# EAGLE design v1.2SMD (EAGLE 7.4.0)
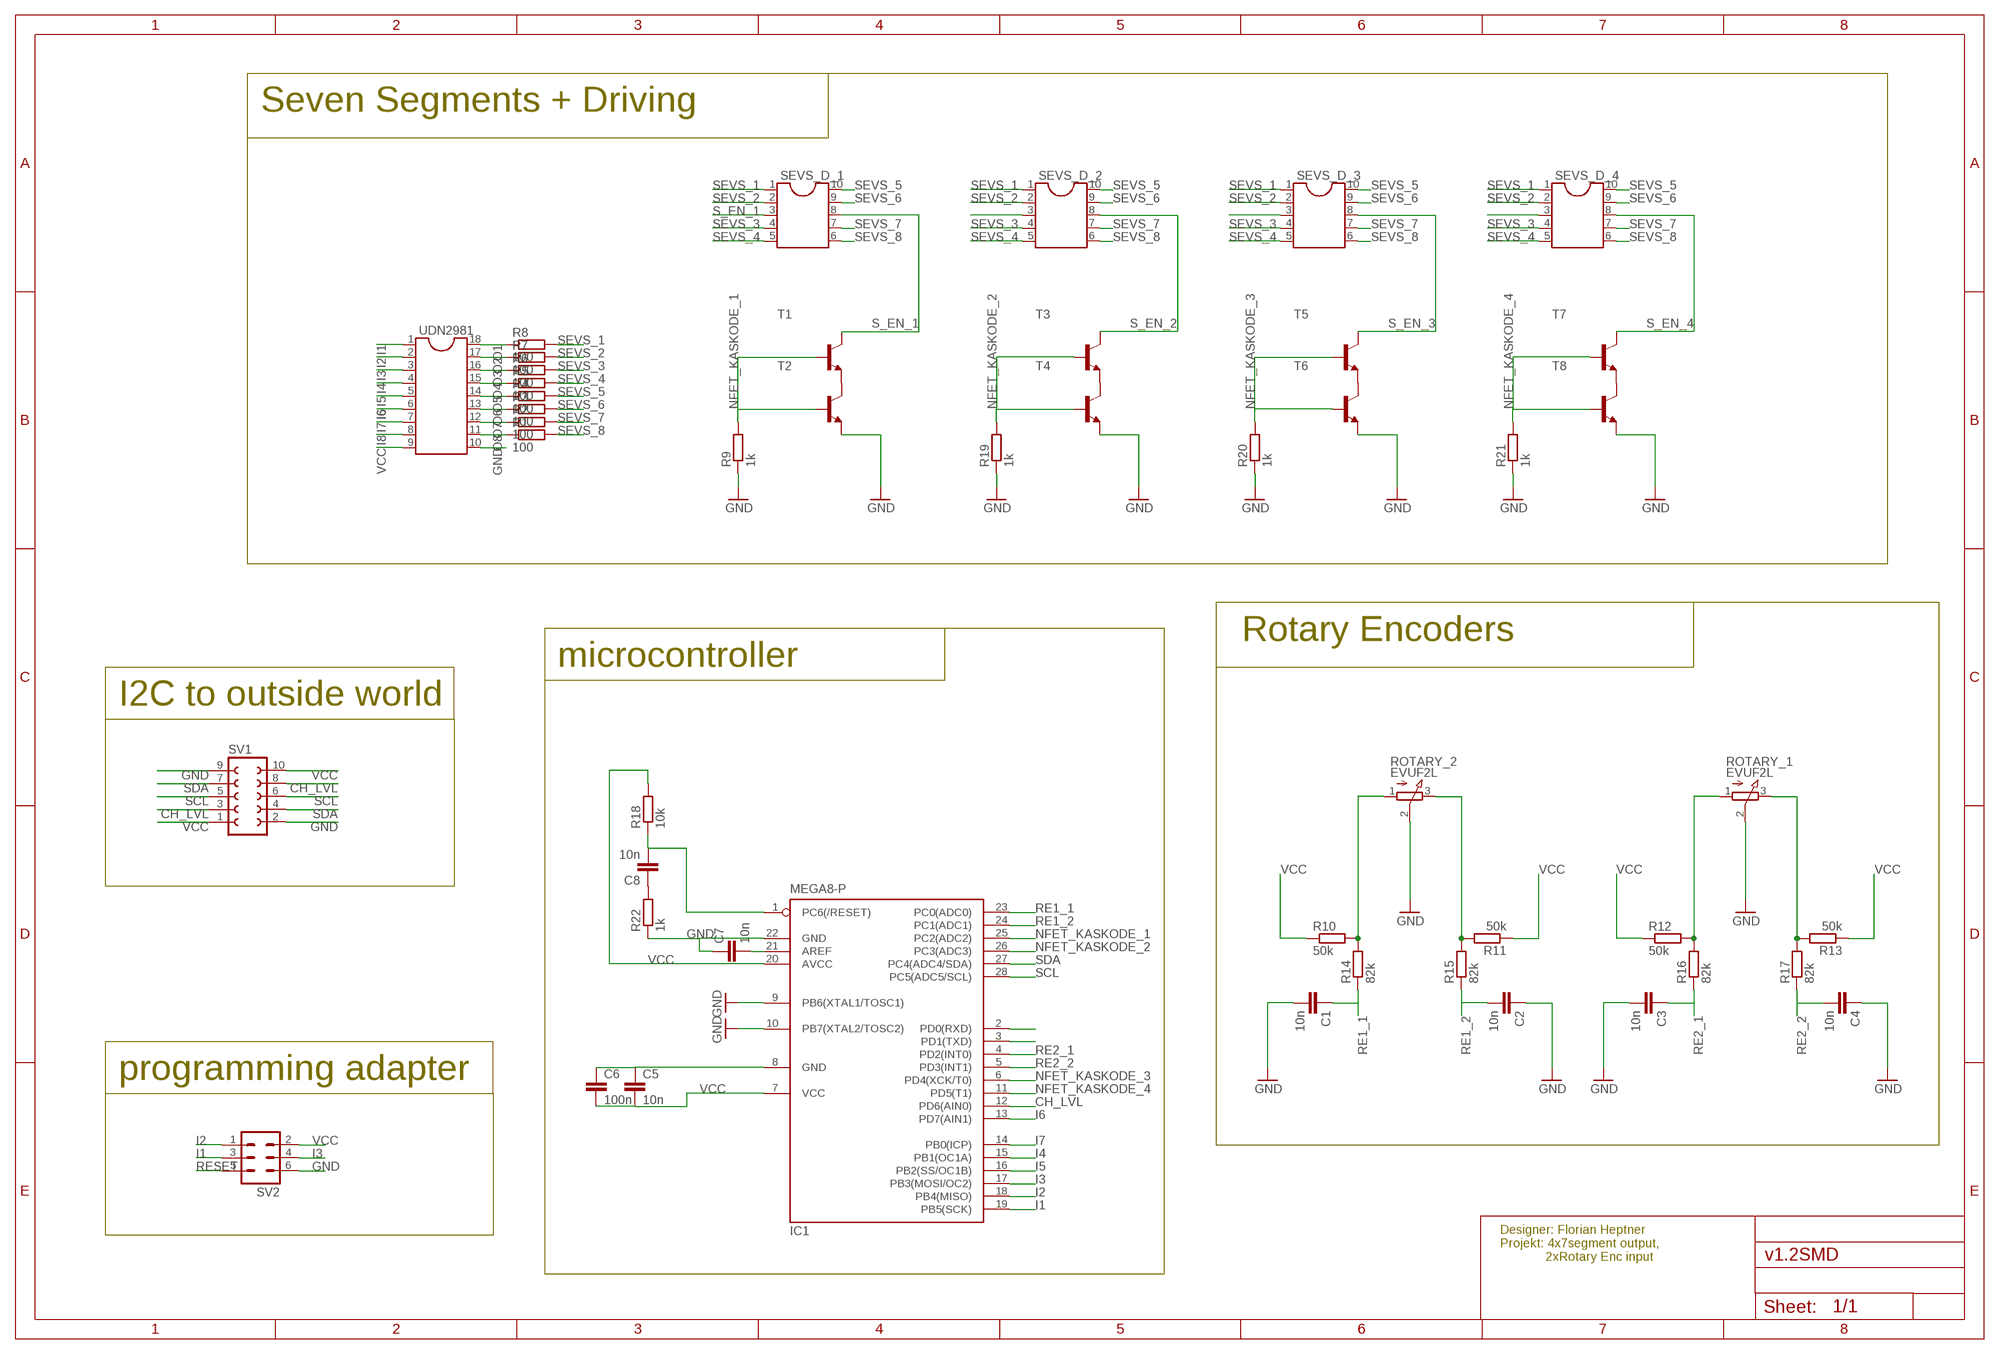
[diagram p0: schematic, sheet 1]

## Parts
C1  10n  C-EUC0603  [C0603]
C2  10n  C-EUC0603  [C0603]
C3  10n  C-EUC0603  [C0603]
C4  10n  C-EUC0603  [C0603]
C5  10n  C-EUC0603  [C0603]
C6  100n  C-EUC0603  [C0603]
C7  10n  C-EUC0603  [C0603]
C8  10n  C-EUC0603  [C0603]
IC1  MEGA8-P  [DIL28-3]
R1  100  R-EU_R0603  [R0603]
R2  100  R-EU_R0603  [R0603]
R3  100  R-EU_R0603  [R0603]
R4  100  R-EU_R0603  [R0603]
R5  100  R-EU_R0603  [R0603]
R6  100  R-EU_R0603  [R0603]
R7  100  R-EU_R0603  [R0603]
R8  100  R-EU_R0603  [R0603]
R9  1k  R-EU_R0603  [R0603]
R10  50k  R-EU_R0603  [R0603]
R11  50k  R-EU_R0603  [R0603]
R12  50k  R-EU_R0603  [R0603]
R13  50k  R-EU_R0603  [R0603]
R14  82k  R-EU_R0603  [R0603]
R15  82k  R-EU_R0603  [R0603]
R16  82k  R-EU_R0603  [R0603]
R17  82k  R-EU_R0603  [R0603]
R18  10k  R-EU_R0603  [R0603]
R19  1k  R-EU_R0603  [R0603]
R20  1k  R-EU_R0603  [R0603]
R21  1k  R-EU_R0603  [R0603]
R22  1k  R-EU_R0603  [R0603]
ROTARY_1  EVUF2L  [EVUFXL]
ROTARY_2  EVUF2L  [EVUFXL]
SEVS_D_1  DIL10  [DIL10]
SEVS_D_2  DIL10  [DIL10]
SEVS_D_3  DIL10  [DIL10]
SEVS_D_4  DIL10  [DIL10]
SV1  FE05-2  [FE05-2]
SV2  ML6  [ML6]
T1  BC808-NPN-SOT23-BEC  [SOT23-BEC]
T2  BC808-NPN-SOT23-BEC  [SOT23-BEC]
T3  BC808-NPN-SOT23-BEC  [SOT23-BEC]
T4  BC808-NPN-SOT23-BEC  [SOT23-BEC]
T5  BC808-NPN-SOT23-BEC  [SOT23-BEC]
T6  BC808-NPN-SOT23-BEC  [SOT23-BEC]
T7  BC808-NPN-SOT23-BEC  [SOT23-BEC]
T8  BC808-NPN-SOT23-BEC  [SOT23-BEC]
UDN2981  DIL18  [DIL18]

## Nets
CH_LVL: IC1.12(PD6(AIN0)) SV1.3 SV1.8
GND: C1.2 C2.1 C3.2 C4.1 C7.1 IC1.9(PB6(XTAL1/TOSC1)) IC1.10(PB7(XTAL2/TOSC2)) IC1.22(GND) R9.1 R19.1 R20.1 R21.1 R22.1 ROTARY_1.2(S) ROTARY_2.2(S) SV1.2 SV1.9 SV2.6 T2.E T4.E T6.E T8.E UDN2981.10
I1: IC1.19(PB5(SCK)) SV2.3 UDN2981.1
I2: IC1.18(PB4(MISO)) SV2.1 UDN2981.2
I3: IC1.17(PB3(MOSI/OC2)) SV2.4 UDN2981.3
I4: IC1.15(PB1(OC1A)) UDN2981.4
I5: IC1.16(PB2(SS/OC1B)) UDN2981.5
I6: IC1.13(PD7(AIN1)) UDN2981.6
I7: IC1.14(PB0(ICP)) UDN2981.7
I8: UDN2981.8
N$1: R11.2 R15.2 ROTARY_2.3(E)
N$2: C8.1 R22.2
N$3: IC1.3(PD1(TXD))
N$4: R10.2 R14.2 ROTARY_2.1(A)
N$5: R12.2 R16.2 ROTARY_1.1(A)
N$6: R13.2 R17.2 ROTARY_1.3(E)
N$7: T1.E T2.C
N$8: T3.E T4.C
N$9: T5.E T6.C
N$10: T7.E T8.C
N$11: IC1.2(PD0(RXD))
N$12: C5.1 C6.1 IC1.8(GND)
N$15: C7.2 IC1.21(AREF)
NFET_KASKODE_1: IC1.25(PC2(ADC2)) R9.2 T1.B T2.B
NFET_KASKODE_2: IC1.26(PC3(ADC3)) R19.2 T3.B T4.B
NFET_KASKODE_3: IC1.6(PD4(XCK/T0)) R20.2 T5.B T6.B
NFET_KASKODE_4: IC1.11(PD5(T1)) R21.2 T7.B T8.B
O1: R8.1 UDN2981.18
O2: R7.1 UDN2981.17
O3: R6.1 UDN2981.16
O4: R5.1 UDN2981.15
O5: R4.1 UDN2981.14
O6: R3.1 UDN2981.13
O7: R2.1 UDN2981.12
O8: R1.1 UDN2981.11
RE1_1: C1.1 IC1.23(PC0(ADC0)) R14.1
RE1_2: C2.2 IC1.24(PC1(ADC1)) R15.1
RE2_1: C3.1 IC1.4(PD2(INT0)) R16.1
RE2_2: C4.2 IC1.5(PD3(INT1)) R17.1
RESET: C8.2 IC1.1(PC6(/RESET)) R18.1 SV2.5
S_EN_1: SEVS_D_1.3 SEVS_D_1.8 T1.C
S_EN_2: SEVS_D_2.3 SEVS_D_2.8 T3.C
S_EN_3: SEVS_D_3.3 SEVS_D_3.8 T5.C
S_EN_4: SEVS_D_4.3 SEVS_D_4.8 T7.C
SCL: IC1.28(PC5(ADC5/SCL)) SV1.5 SV1.6
SDA: IC1.27(PC4(ADC4/SDA)) SV1.4 SV1.7
SEVS_1: R8.2 SEVS_D_1.1 SEVS_D_2.1 SEVS_D_3.1 SEVS_D_4.1
SEVS_2: R7.2 SEVS_D_1.2 SEVS_D_2.2 SEVS_D_3.2 SEVS_D_4.2
SEVS_3: R6.2 SEVS_D_1.4 SEVS_D_2.4 SEVS_D_3.4 SEVS_D_4.4
SEVS_4: R5.2 SEVS_D_1.5 SEVS_D_2.5 SEVS_D_3.5 SEVS_D_4.5
SEVS_5: R4.2 SEVS_D_1.10 SEVS_D_2.10 SEVS_D_3.10 SEVS_D_4.10
SEVS_6: R3.2 SEVS_D_1.9 SEVS_D_2.9 SEVS_D_3.9 SEVS_D_4.9
SEVS_7: R2.2 SEVS_D_1.7 SEVS_D_2.7 SEVS_D_3.7 SEVS_D_4.7
SEVS_8: R1.2 SEVS_D_1.6 SEVS_D_2.6 SEVS_D_3.6 SEVS_D_4.6
VCC: C5.2 C6.2 IC1.7(VCC) IC1.20(AVCC) R10.1 R11.1 R12.1 R13.1 R18.2 SV1.1 SV1.10 SV2.2 UDN2981.9

## Notes on the sheet
- Seven Segments + Driving
- Rotary Encoders
- microcontroller
- I2C to outside world
- programming adapter
- Designer: Florian Heptner
  Projekt: 4x7segment output,
               2xRotary Enc input

## Library data of the parts
C1-C8 = rcl:C-EU: CAPACITOR, European symbol
IC1 = atmel:MEGA8-P: MICROCONTROLLER 8 Kbytes FLASH, 1 kbytes SRAM, 512 bytes EEPROM, USART, 4-channel 10 bit ADC, 2-channel 8 bit ADC Pin compatible with Atmega48, ATMega88, ATMega168 Source: avr.lbr; OC_FARNELL: unknown; OC_NEWARK: unknown
R1-R22 = rcl:R-EU_: RESISTOR, European symbol
ROTARY_1 ROTARY_2 = pot:EVU: 9 mm Square Rotary Potentiometers Source: Panasonic
SEVS_D_1-SEVS_D_4 = ic-package:DIL10: Dual In Line / Socket
SV1 = con-lsta:FE05-2: FEMALE HEADER; OC_FARNELL: unknown; OC_NEWARK: unknown
SV2 = con-harting-ml:ML6: HARTING; OC_FARNELL: unknown; OC_NEWARK: unknown
T1-T8 = transistor:*-NPN-: NPN Transistror BF959 corrected 2008.03.06
UDN2981 = ic-package:DIL18: Dual In Line / Socket

## Board
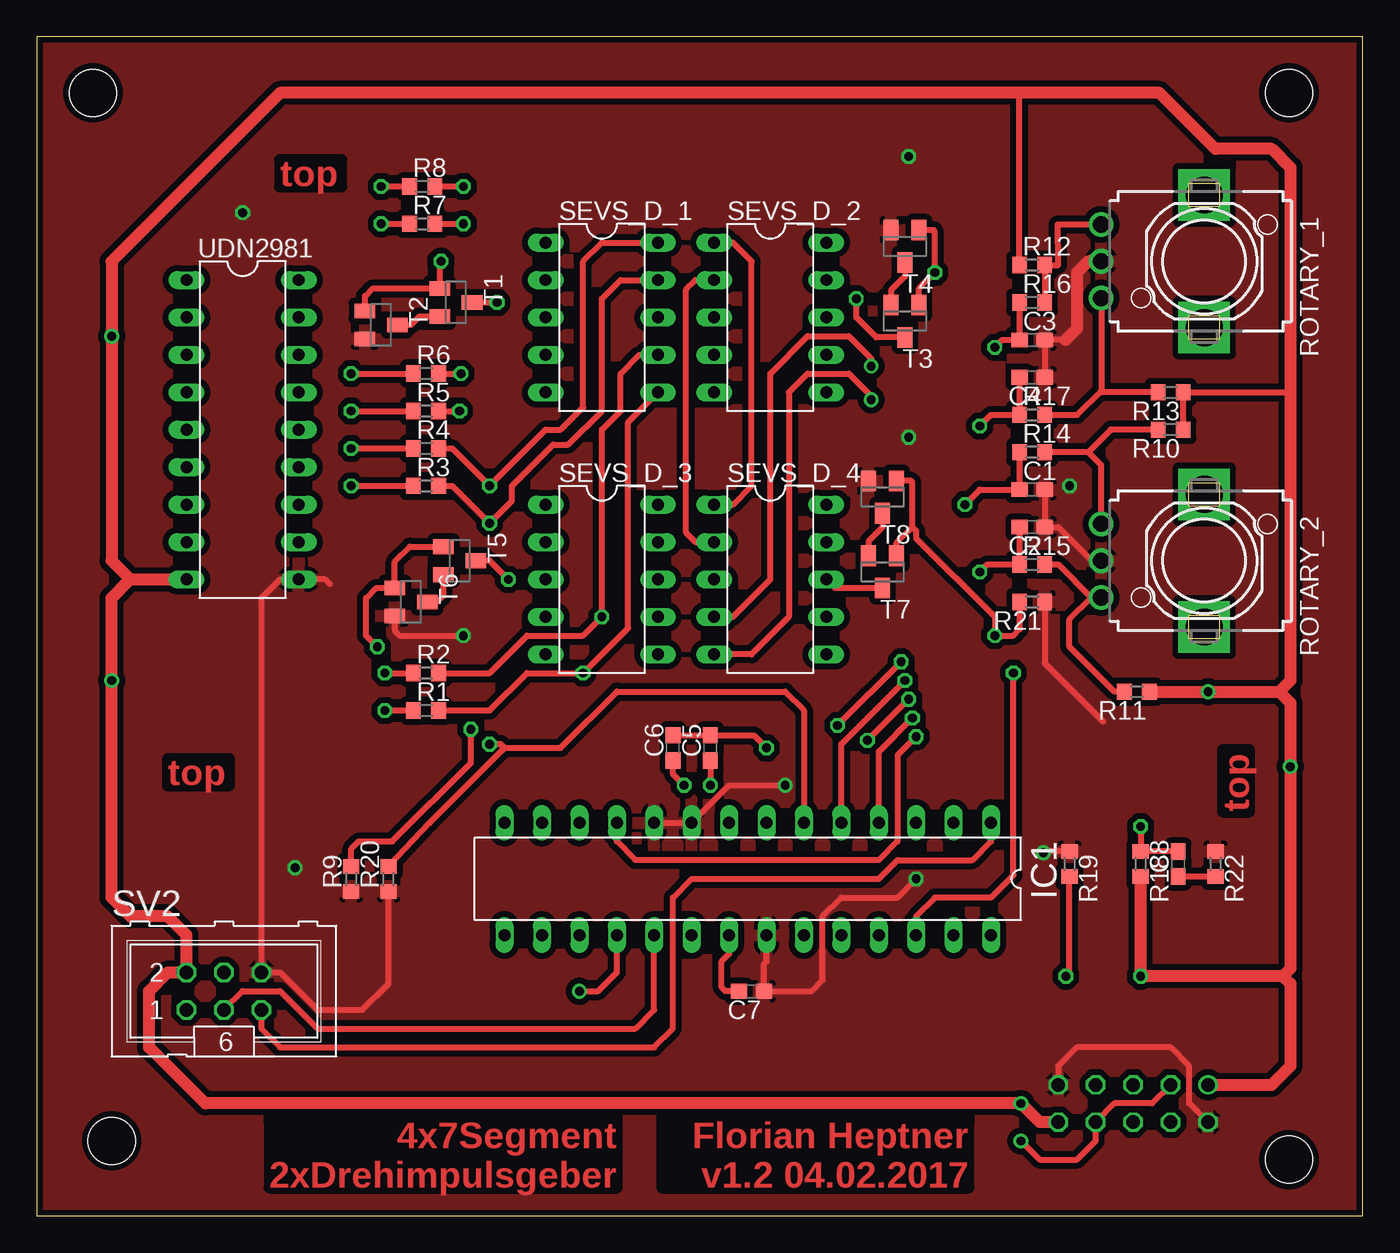
[diagram p1: board, top side]
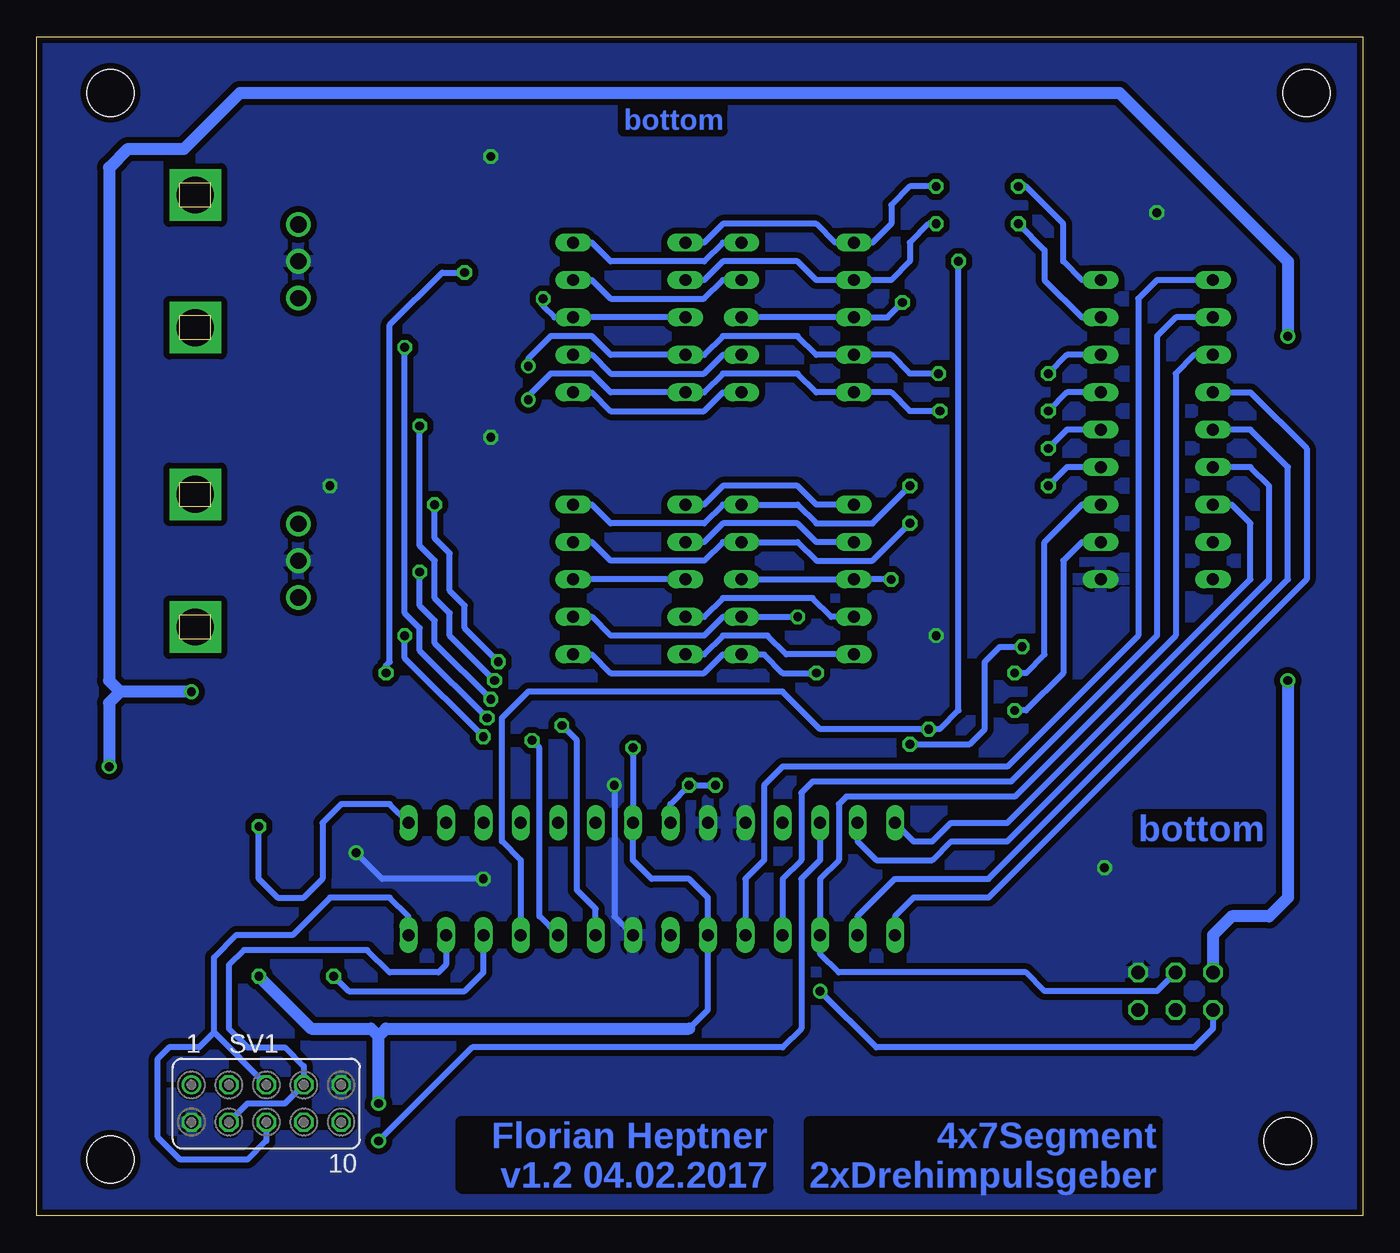
[diagram p2: board, bottom side, seen from below]

Size 90 x 80 mm. Coordinates in mm from the lower left corner, seen from the top.
Outline: 0,0 90,0 90,80 0,80 0,0
Copper layers (1*16): Top 0.035mm / dielectric 1.5mm / Bottom 0.035mm
Design rules "ZWILLING": minimum track width 0.2mm, minimum drill 0.5mm, track to track 0.2mm, track to pad 0.2mm, pad to pad 0.15mm, via to via 0.2mm, smd to smd 0mil, copper to edge 0.2mm, drill to drill 0.2mm, minimum pad ring 0.2mm, minimum via ring 0.2mm, stop-mask expansion 0.1mm, vias tented up to drill 0mil, thermal gap 10mil
Holes 3.2 mm at 85,76.2 85,3.81 5.08,5.08 3.81,76.2

### Footprints (pad centres in the part's own frame; a part is rotated, then mirrored left to right if it is on the bottom)
C0603 = smd 1.1 x 1: 1 -0.85,0; 2 0.85,0
DIL28-3 = drill 0.813 long: 1 -16.51,-3.81; 2 -13.97,-3.81; 3 -11.43,-3.81; 4 -8.89,-3.81; 5 -6.35,-3.81; 6 -3.81,-3.81; 7 -1.27,-3.81; 8 1.27,-3.81; 9 3.81,-3.81; 10 6.35,-3.81; 11 8.89,-3.81; 12 11.43,-3.81; 13 13.97,-3.81; 14 16.51,-3.81; 15 16.51,3.81; 16 13.97,3.81; 17 11.43,3.81; 18 8.89,3.81; 19 6.35,3.81; 20 3.81,3.81; 21 1.27,3.81; 22 -1.27,3.81; 23 -3.81,3.81; 24 -6.35,3.81; 25 -8.89,3.81; 26 -11.43,3.81; 27 -13.97,3.81; 28 -16.51,3.81
R0603 = smd 1 x 1.1: 1 -0.85,0; 2 0.85,0
EVUFXL = drill 1.1 pad 1.676: 1 -2.5,-7; 2 0,-7; 3 2.5,-7 | drill 2.5 pad 3.5 square: M1 4.5,0; M2 -4.5,0
DIL10 = drill 0.813 long: 1 -5.08,-3.81; 2 -2.54,-3.81; 3 0,-3.81; 4 2.54,-3.81; 5 5.08,-3.81; 6 5.08,3.81; 7 2.54,3.81; 8 0,3.81; 9 -2.54,3.81; 10 -5.08,3.81
FE05-2 = drill 0.914: 1 -5.08,1.27 | drill 0.914 octagon: 2 -5.08,-1.27; 3 -2.54,1.27; 4 -2.54,-1.27; 5 0,1.27; 6 0,-1.27; 7 2.54,1.27; 8 2.54,-1.27; 9 5.08,1.27; 10 5.08,-1.27
ML6 = drill 0.914 octagon: 1 -2.54,-1.27; 2 -2.54,1.27; 3 0,-1.27; 4 0,1.27; 5 2.54,-1.27; 6 2.54,1.27
SOT23-BEC = smd 1 x 1.4: B -0.95,-1.1; C 0,1.1; E 0.95,-1.1
DIL18 = drill 0.813 long: 1 -10.16,-3.81; 2 -7.62,-3.81; 3 -5.08,-3.81; 4 -2.54,-3.81; 5 0,-3.81; 6 2.54,-3.81; 7 5.08,-3.81; 8 7.62,-3.81; 9 10.16,-3.81; 10 10.16,3.81; 11 7.62,3.81; 12 5.08,3.81; 13 2.54,3.81; 14 0,3.81; 15 -2.54,3.81; 16 -5.08,3.81; 17 -7.62,3.81; 18 -10.16,3.81

### Placement (x,y rotation side)
C1  67.56,49.28 0 top
C2  67.56,46.74 180 top
C3  67.56,59.44 0 top
C4  67.56,56.9 180 top
C5  45.72,31.75 90 top
C6  43.18,31.75 90 top
C7  48.51,15.24 180 top
C8  77.47,23.88 90 top
IC1  48.26,22.86 180 top
R1  26.42,34.29 0 top
R2  26.42,36.83 0 top
R3  26.42,49.53 0 top
R4  26.42,52.07 0 top
R5  26.42,54.61 0 top
R6  26.42,57.15 0 top
R7  26.16,67.31 0 top
R8  26.16,69.85 0 top
R9  21.34,22.86 90 top
R10  76.96,53.34 180 top
R11  74.68,35.56 180 top
R12  67.56,64.52 0 top
R13  76.96,55.88 180 top
R14  67.56,51.82 0 top
R15  67.56,44.2 0 top
R16  67.56,61.98 0 top
R17  67.56,54.36 0 top
R18  74.93,23.88 270 top
R19  70.1,23.88 270 top
R20  23.88,22.86 90 top
R21  67.56,41.66 180 top
R22  80.01,23.88 270 top
ROTARY_1  79.25,64.77 270 top
ROTARY_2  79.25,44.45 270 top
SEVS_D_1  38.35,60.96 270 top
SEVS_D_2  49.78,60.96 270 top
SEVS_D_3  38.35,43.18 270 top
SEVS_D_4  49.78,43.18 270 top
SV1  74.42,7.62 0 bottom
SV2  12.7,15.24 0 top
T1  28.45,61.98 270 top
T2  23.37,60.45 270 top
T3  58.93,60.71 180 top
T4  58.93,65.79 180 top
T5  28.7,44.45 270 top
T6  25.4,41.66 270 top
T7  57.4,43.69 180 top
T8  57.4,48.77 180 top
UDN2981  13.97,53.34 270 top

### Tracks (layer width: path | path; a pad name or v marks a point on that pad's centre or on a via)
CH_LVL  (via drill 0.6)
  Top 0.406: v66.8,5.08 68.07,3.81 70.61,3.81 71.88,5.08 SV1.8 73.15,7.62 75.69,7.62 SV1.3
  Bottom 0.406: IC1.12 36.83,24.13 38.1,22.86 38.1,12.7 39.37,11.43 60.45,11.43 v66.8,5.08
GND  (via drill 0.6)
  Top 0.406: v59.69,22.86 58.42,21.59 54.61,21.59 53.34,20.32 53.34,16 52.58,15.24 C7.1 49.36,17.11 49.53,17.27 IC1.22 | IC1.10 IC1.9 46.99,29.21 v50.8,29.21 | SV1.2 78.23,7.62 78.23,10.16 76.96,11.43 70.61,11.43 69.34,10.16 SV1.9 | R19.1 68.41,24.73 v68.33,24.64 | R20.1 23.88,15.75 22.1,13.97 19.05,13.97 16.51,16.51 SV2.6 15.24,41.91 16.51,43.18 UDN2981.10 19.56,43.18 19.88,42.86 | C1.2 C2.1 69.34,46.74 71.63,44.45 ROTARY_2.2 | C4.1 C3.2 69.85,59.44 | R21.1 68.41,37.5 72.39,33.53 | T6.E 24.3,39.71 24.64,39.37 v28.96,39.37
  Top 0.813: ROTARY_1.2 71.37,64.77 70.61,64.01 70.61,60.2 69.85,59.44
  Bottom 0.406: v59.69,22.86 66.55,22.86 v68.33,24.64 | v50.8,29.21 50.8,20.32 IC1.22
  other vias: 70.1,49.53 59.18,52.83 59.18,71.88 13.97,68.07 17.53,23.62
  pour Bottom (isolate 0.406): 0,80.01 0,0 90,0 90,80
  pour Top (isolate 0.406): 0,0 90,0 90,80 0,80.01
I1
  Top 0.406: SV2.3 13.97,15.24 16.51,15.24 19.05,12.7 40.64,12.7 41.91,13.97 IC1.19
  Bottom 0.406: UDN2981.1 13.97,63.5 15.24,62.23 15.24,39.37 24.13,30.48 39.37,30.48 40.64,29.21 40.64,24.13 41.91,22.86 IC1.19
I2  (via drill 0.6)
  Top 0.406: v36.83,15.24 38.1,15.24 39.37,16.51 IC1.18
  Bottom 0.406: UDN2981.2 12.7,60.96 13.97,59.69 13.97,39.37 23.88,29.46 37.34,29.46 38.1,28.7 38.1,24.13 39.37,22.86 IC1.18 | SV2.1 10.16,12.7 11.43,11.43 33.02,11.43 v36.83,15.24
I3
  Bottom 0.406: UDN2981.3 11.43,58.42 12.7,57.15 12.7,39.37 23.62,28.45 35.05,28.45 35.56,27.94 35.56,24.13 36.83,22.86 IC1.17 36.83,17.78 35.56,16.51 22.86,16.51 21.59,15.24 13.97,15.24 SV2.4
I4
  Bottom 0.406: UDN2981.4 7.62,55.88 3.81,52.07 3.81,43.18 25.4,21.59 30.48,21.59 31.75,20.32 IC1.15
I5
  Bottom 0.406: IC1.16 34.29,20.32 31.75,22.86 25.4,22.86 5.08,43.18 5.08,50.8 7.62,53.34 UDN2981.5
I6
  Bottom 0.406: IC1.13 34.29,25.4 33.02,24.13 29.21,24.13 27.94,25.4 24.13,25.4 6.35,43.18 6.35,49.53 7.62,50.8 UDN2981.6
I7
  Bottom 0.406: IC1.14 30.48,25.4 29.21,25.4 27.94,26.67 24.13,26.67 7.62,43.18 7.62,46.99 8.89,48.26 UDN2981.7
N$1
  Top 0.406: R15.2 69.34,44.2 71.59,41.95 | 71.59,41.95 ROTARY_2.3 | R11.2 73.15,35.56 70.1,38.61 70.1,40.47 71.59,41.95
N$2
  Top 0.406: C8.1 R22.2
N$4
  Top 0.406: 71.37,51.82 R14.2 | R10.2 72.9,53.34 71.37,51.82 | ROTARY_2.1 72.25,50.94 71.37,51.82
N$5
  Top 0.406: R16.2 R12.2 69.34,64.52 69.3,67.27 ROTARY_1.1
N$6
  Top 0.406: R17.2 70.61,54.36 72.25,55.99 | R13.2 72.25,55.88 72.25,55.99 | ROTARY_1.3 72.25,55.99
N$7
  Top 0.406: T2.C 25.4,60.45 25.97,61.03 T1.E
N$8
  Top 0.406: T4.C 58.93,63.75 57.98,62.8 T3.E
N$9
  Top 0.406: T6.C 27.18,41.66 27.6,42.08 T5.E
N$10
  Top 0.406: T8.C 57.4,46.74 56.45,45.79 T7.E
N$12  (via drill 0.6)
  Top 0.406: v43.94,29.21 43.18,29.97 C6.1 | C5.1 v45.72,29.21
  Bottom 0.406: IC1.8 46.99,27.94 v45.72,29.21 v43.94,29.21
N$15
  Top 0.406: C7.2 46.74,15.24 46.48,15.49 46.48,17.27 46.99,17.78 IC1.21
NFET_KASKODE_1  (via drill 0.6)
  Top 0.406: T2.B 22.27,62.4 22.79,62.93 T1.B 27.35,64.69 v27.43,64.77 | R9.2 21.34,24.89 21.84,25.4 24.13,25.4 29.46,30.73 v29.46,33.02
  Bottom 0.406: IC1.25 57.15,24.13 58.42,25.4 58.42,33.78 56.64,35.56 39.37,35.56 36.83,33.02 30.99,33.02 v29.46,33.02 28.7,33.02 27.43,34.29 v27.43,64.77
NFET_KASKODE_2  (via drill 0.6)
  Top 0.406: IC1.26 59.69,20.32 60.96,21.59 64.77,21.59 66.29,23.11 v66.29,36.83 | v69.85,16.26 70.1,16.51 R19.2 | T3.B 59.88,62.93 v60.96,64.01 60.96,66.8 60.88,66.89 T4.B
  Bottom 0.406: IC1.26 59.69,16.51 60.96,15.24 68.83,15.24 v69.85,16.26 | v66.29,36.83 66.29,37.34 66.04,37.59 66.04,60.45 62.48,64.01 v60.96,64.01
NFET_KASKODE_3  (via drill 0.6)
  Top 0.406: R20.2 26.67,26.67 31.62,31.62 31.62,31.88 | IC1.6 52.07,34.29 50.8,35.56 39.37,35.56 35.56,31.75 31.75,31.75 31.62,31.88 | 31.62,31.88 31.5,32 v30.73,32 | T5.B 25.33,45.4 24.3,44.37 T6.B 23.05,42.61 22.35,41.91 22.35,39.37 v23.11,38.61
  Bottom 0.406: v30.73,32 26.67,32 25.65,33.02 25.65,37.59 24.64,38.61 v23.11,38.61
NFET_KASKODE_4  (via drill 0.6)
  Top 0.406: IC1.11 39.37,25.4 40.64,24.13 57.15,24.13 58.42,25.4 58.42,31.24 v59.69,32.51 | R21.2 66.71,39.79 66.29,39.37 v65.02,39.37 65.02,40.64 59.69,45.97 59.69,46.48 59.44,46.74 | T7.B 58.35,45.65 59.44,46.74 | 59.44,46.74 59.44,49.78 59.35,49.87 T8.B
  Bottom 0.406: v59.69,32.51 65.02,37.85 v65.02,39.37
O1  (via drill 0.6)
  Top 0.406: v23.37,69.85 R8.1
  Bottom 0.406: UDN2981.18 19.05,63.5 20.32,64.77 20.32,67.31 22.86,69.85 v23.37,69.85
O2  (via drill 0.6)
  Top 0.406: v23.37,67.31 R7.1
  Bottom 0.406: UDN2981.17 19.05,60.96 21.59,63.5 21.59,65.53 v23.37,67.31
O3  (via drill 0.6)
  Top 0.406: v21.34,57.15 R6.1
  Bottom 0.406: UDN2981.16 20.07,58.42 v21.34,57.15
O4  (via drill 0.6)
  Top 0.406: v21.34,54.61 R5.1
  Bottom 0.406: UDN2981.15 20.07,55.88 v21.34,54.61
O5  (via drill 0.6)
  Top 0.406: v21.34,52.07 R4.1
  Bottom 0.406: UDN2981.14 20.07,53.34 v21.34,52.07
O6  (via drill 0.6)
  Top 0.406: v21.34,49.53 R3.1
  Bottom 0.406: UDN2981.13 20.07,50.8 v21.34,49.53
O7  (via drill 0.6)
  Top 0.406: v23.62,36.83 R2.1
  Bottom 0.406: UDN2981.12 19.05,48.26 21.59,45.72 21.59,38.1 22.86,36.83 v23.62,36.83
O8  (via drill 0.6)
  Top 0.406: v23.62,34.29 R1.1
  Bottom 0.406: UDN2981.11 19.05,45.72 20.32,44.45 20.32,36.83 22.86,34.29 v23.62,34.29
RE1_1  (via drill 0.6)
  Top 0.406: R14.1 C1.1 64.01,49.28 v62.99,48.26 | v54.36,33.27 v58.67,37.59
  Bottom 0.406: IC1.23 52.07,20.83 53.34,22.1 53.34,32.26 v54.36,33.27 | v58.67,37.59 60.96,39.88 60.96,41.4 61.98,42.42 61.98,44.96 62.99,45.97 v62.99,48.26
RE1_2  (via drill 0.6)
  Top 0.406: C2.2 R15.1 64.52,44.2 v64.01,43.69 | v56.39,32.26 v59.18,35.05
  Bottom 0.406: IC1.24 55.88,20.32 55.88,31.75 v56.39,32.26 | v59.18,35.05 62.99,38.86 62.99,40.39 64.01,41.4 v64.01,43.69
RE2_1  (via drill 0.6)
  Top 0.406: IC1.4 57.15,31.5 v59.44,33.78 | R16.1 C3.1 65.53,59.44 v65.02,58.93
  Bottom 0.406: v59.44,33.78 64.01,38.35 64.01,39.88 65.02,40.89 v65.02,58.93
RE2_2  (via drill 0.6)
  Top 0.406: IC1.5 54.61,32 v58.93,36.32 | C4.2 R17.1 64.77,54.36 v64.01,53.59
  Bottom 0.406: v58.93,36.32 61.98,39.37 61.98,40.89 62.99,41.91 62.99,44.45 64.01,45.47 v64.01,53.59
RESET  (via drill 0.6)
  Top 0.406: SV2.5 15.24,12.7 16.51,11.43 41.91,11.43 43.18,12.7 43.18,21.59 44.45,22.86 57.15,22.86 58.42,24.13 63.5,24.13 64.77,25.4 IC1.1 | v74.93,26.42 R18.1 C8.2
  Bottom 0.406: IC1.1 66.04,27.94 69.34,27.94 70.61,26.67 70.61,22.86 71.88,21.59 73.66,21.59 74.93,22.86 v74.93,26.42
S_EN_1  (via drill 0.6)
  Top 0.406: T1.C v31.24,61.98
  Bottom 0.406: SEVS_D_1.8 SEVS_D_1.3 32.26,60.96 v31.24,61.98
S_EN_2  (via drill 0.6)
  Top 0.406: v55.63,62.23 55.63,60.96 56.98,59.61 T3.C
  Bottom 0.406: SEVS_D_2.3 SEVS_D_2.8 54.86,60.96 55.63,61.72 v55.63,62.23
S_EN_3  (via drill 0.6)
  Top 0.406: v32,43.18 30.73,44.45 T5.C
  Bottom 0.406: SEVS_D_3.8 SEVS_D_3.3 v32,43.18
S_EN_4
  Top 0.406: T7.C 54.19,42.59 SEVS_D_4.8
  Bottom 0.406: SEVS_D_4.3 SEVS_D_4.8
SCL
  Bottom 0.406: IC1.28 64.77,20.32 66.04,21.59 70.1,21.59 72.64,19.05 76.45,19.05 77.98,17.53 77.98,12.45 | SV1.6 74.42,5.08 75.69,3.81 80.26,3.81 81.79,5.33 81.79,10.67 81.03,11.43 78.99,11.43 77.98,12.45 | SV1.5 77.98,12.45
SDA
  Bottom 0.406: IC1.27 62.23,17.02 62.74,16.51 66.04,16.51 67.56,18.03 75.95,18.03 76.96,17.02 76.96,12.7 75.69,11.43 73.15,11.43 71.88,10.16 SV1.7 73.15,7.62 75.69,7.62 SV1.4
SEVS_1  (via drill 0.6)
  Top 0.406: SEVS_D_4.1 47.24,48.26 48.51,49.53 48.51,64.77 47.24,66.04 SEVS_D_2.1 | R8.2 v28.96,69.85
  Bottom 0.406: SEVS_D_2.1 44.7,66.04 43.43,67.31 37.08,67.31 35.81,66.04 SEVS_D_1.1 33.27,66.04 32,67.31 32,68.58 30.73,69.85 v28.96,69.85 | SEVS_D_3.1 37.08,48.26 38.35,49.53 43.43,49.53 44.7,48.26 SEVS_D_4.1
SEVS_2  (via drill 0.6)
  Top 0.406: SEVS_D_2.2 44.7,63.5 44.07,62.87 44.07,46.35 44.7,45.72 SEVS_D_4.2 | R7.2 v28.96,67.31
  Bottom 0.406: SEVS_D_2.2 44.7,63.5 43.43,64.77 38.35,64.77 37.08,63.5 SEVS_D_1.2 32,63.5 30.73,64.77 30.73,66.04 29.46,67.31 v28.96,67.31 | SEVS_D_3.2 37.08,45.72 38.35,46.99 43.43,46.99 44.7,45.72 SEVS_D_4.2
SEVS_3  (via drill 0.6)
  Top 0.406: SEVS_D_4.4 47.24,40.64 49.78,43.18 49.78,57.15 52.32,59.69 55.12,59.69 56.64,58.17 v56.64,57.66 | R6.2 v28.79,57.15
  Bottom 0.406: SEVS_D_3.4 36.07,40.64 37.34,41.91 43.43,41.91 44.7,40.64 SEVS_D_4.4 | v56.64,57.66 56.64,58.17 55.12,59.69 52.32,59.69 51.05,58.42 SEVS_D_2.4 44.7,58.42 43.43,59.69 38.35,59.69 37.08,58.42 SEVS_D_1.4 32,58.42 30.73,57.15 v28.79,57.15
SEVS_4  (via drill 0.6)
  Top 0.406: SEVS_D_4.5 48.51,38.1 51.05,40.64 51.05,55.88 52.32,57.15 55.12,57.15 56.64,55.63 v56.64,55.37 | R5.2 v28.7,54.61
  Bottom 0.406: SEVS_D_3.5 39.12,38.1 40.39,39.37 43.43,39.37 44.7,38.1 SEVS_D_4.5 | v28.7,54.61 30.73,54.61 32,55.88 SEVS_D_1.5 37.08,55.88 38.35,57.15 43.43,57.15 44.7,55.88 SEVS_D_2.5 51.05,55.88 52.32,57.15 55.12,57.15 56.64,55.63 v56.64,55.37
SEVS_5  (via drill 0.6)
  Top 0.406: SEVS_D_1.10 38.35,66.04 37.08,64.77 37.08,54.86 35.56,53.34 34.54,53.34 v30.73,49.53 28.19,52.07 R4.2
  Bottom 0.406: SEVS_D_4.10 52.32,48.26 51.05,46.99 44.7,46.99 43.43,48.26 SEVS_D_3.10 38.35,48.26 37.08,46.99 33.27,46.99 v30.73,49.53 | SEVS_D_2.10 52.32,66.04 51.05,64.77 44.7,64.77 43.43,66.04 SEVS_D_1.10
SEVS_6  (via drill 0.6)
  Top 0.406: SEVS_D_1.9 39.62,63.5 38.35,62.23 38.35,54.61 36.07,52.32 35.05,52.32 32.26,49.53 32.26,48.51 v30.73,46.99 28.19,49.53 R3.2
  Bottom 0.406: SEVS_D_4.9 52.32,45.72 51.05,44.45 44.7,44.45 43.43,45.72 SEVS_D_3.9 38.35,45.72 37.08,44.45 33.27,44.45 v30.73,46.99 | SEVS_D_1.9 43.43,63.5 44.7,62.23 51.05,62.23 52.32,63.5 SEVS_D_2.9
SEVS_7  (via drill 0.6)
  Top 0.406: R2.2 30.73,36.83 33.27,39.37 37.08,39.37 v38.35,40.64 38.35,53.34 39.62,54.61 39.62,57.15 40.89,58.42 SEVS_D_1.7
  Bottom 0.406: SEVS_D_4.7 52.32,40.64 51.05,39.37 44.7,39.37 43.43,40.64 SEVS_D_3.7 v38.35,40.64 | SEVS_D_1.7 43.43,58.42 44.7,57.15 51.05,57.15 52.32,58.42 SEVS_D_2.7
SEVS_8  (via drill 0.6)
  Top 0.406: R1.2 30.73,34.29 33.27,36.83 v37.08,36.83 40.13,39.88 40.13,53.85 SEVS_D_1.6
  Bottom 0.406: SEVS_D_4.6 52.32,38.1 51.05,36.83 44.7,36.83 43.43,38.1 SEVS_D_3.6 40.64,38.1 39.37,36.83 v37.08,36.83 | SEVS_D_2.6 52.32,55.88 51.05,54.61 44.7,54.61 43.43,55.88 SEVS_D_1.6
VCC  (via drill 0.6)
  Top 0.406: R12.1 66.71,76.2 | R10.1 R13.1 84.84,55.88 85.09,55.63 | C6.2 C5.2 48.68,32.6 v49.53,31.75
  Top 0.813: 6.35,43.18 5.08,41.91 5.08,21.59 6.35,20.32 8.89,20.32 10.16,19.05 SV2.2 8.89,16.51 7.62,15.24 7.62,11.43 11.43,7.62 v66.8,7.62 68.07,6.35 SV1.10 | 6.35,43.18 5.08,44.45 v5.08,59.69 5.08,64.77 16.51,76.2 66.71,76.2 76.2,76.2 80.01,72.39 83.82,72.39 85.09,71.12 85.09,55.63 85.09,36.32 84.33,35.56 | 6.35,43.18 UDN2981.9 | R11.1 84.33,35.56 | 84.33,35.56 85.09,34.8 v85.09,30.48 85.09,16.76 84.58,16.26 | 84.58,16.26 85.09,15.75 85.09,10.16 83.82,8.89 SV1.1 | 84.58,16.26 v74.93,16.26 R18.2
  Bottom 0.406: v49.53,31.75 IC1.7 49.53,24.13 48.26,22.86 45.72,22.86 44.45,21.59 IC1.20 44.45,13.97 45.72,12.7 | 79.59,35.56 v79.5,35.56
  Bottom 0.813: 84.33,35.56 85.09,34.8 v85.09,30.48 | 79.59,35.56 84.33,35.56 | v5.08,59.69 5.08,64.77 16.51,76.2 76.2,76.2 80.01,72.39 83.82,72.39 85.09,71.12 85.09,36.32 84.33,35.56 | 66.8,12.19 67.31,12.7 71.37,12.7 v74.93,16.26 | 66.8,12.19 66.29,12.7 45.72,12.7 | v66.8,7.62 66.8,12.19 | v5.08,36.32 5.08,21.59 6.35,20.32 8.89,20.32 10.16,19.05 SV2.2

### Text on the board
Top: top | top | top | 4x7Segment / 2xDrehimpulsgeber | Florian Heptner / v1.2 04.02.2017
Bottom: bottom | bottom | 4x7Segment / 2xDrehimpulsgeber | Florian Heptner / v1.2 04.02.2017